# Altium schematic sheet 01_MCU.SchDoc
size A4; SheetNumber: 1; SheetTotal: 5
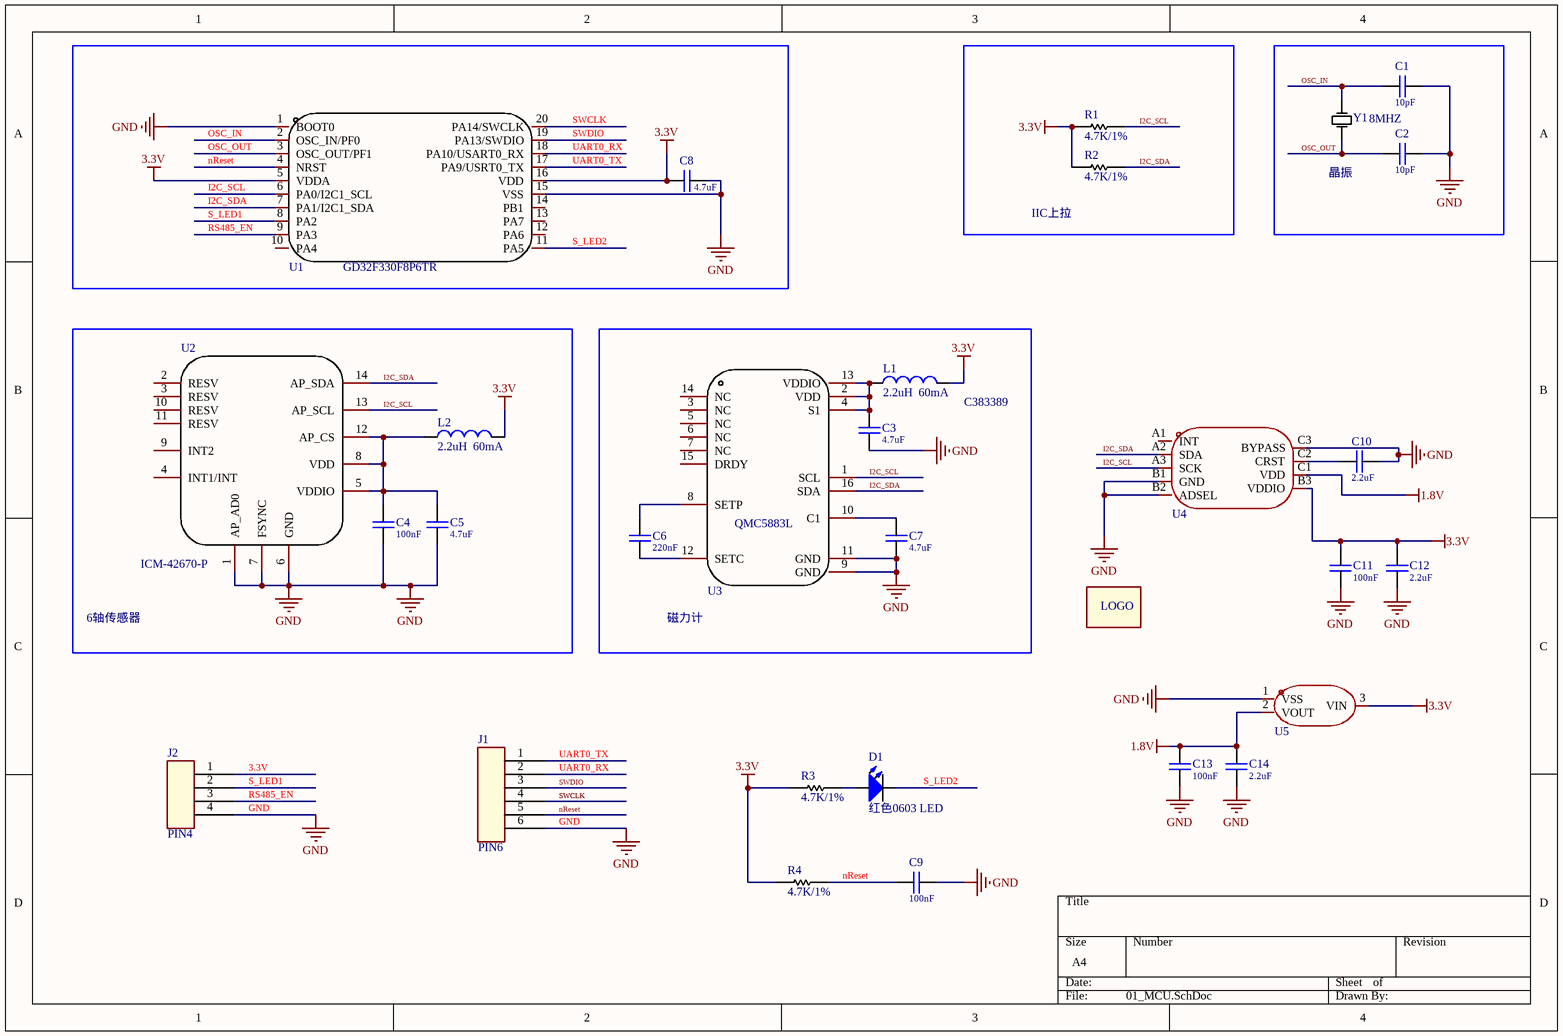
[diagram p0: 01_MCU.SchDoc]

## Parts
C1  10pF  [C0402_M]
C2  10pF  [C0402_M]
C3  4.7uF  [0603C2]
C4  100nF  [C0402_M]
C5  4.7uF  [0603C2]
C6  220nF  [C0402_M]
C7  4.7uF  [0603C2]
C8  4.7uF  [0603C2]
C9  100nF  [C0402_M]
C10  2.2uF  [0603C2]
C11  100nF  [C0402_M]
C12  2.2uF  [0603C2]
C13  100nF  [C0402_M]
C14  2.2uF  [0603C2]
D1  红色0603 LED  [0603_LED_S1]
J1  PIN6  [HDR2.54-LI-6P]
J2  PIN4  [HDR2.54-LI-4P]
L1  2.2uH  60mA  [L0402]
L2  2.2uH  60mA  [L0402]
logo1  JJ_LOGO  [JJ-LOGO]  (value not drawn)
R1  4.7K/1%  [R0402_M]
R2  4.7K/1%  [R0402_M]
R3  4.7K/1%  [R0402_M]
R4  4.7K/1%  [R0402_M]
U1  GD32F330F8P6TR  [TSSOP-20_L6.5-W4.4-P0.65-LS6.4-BL]
U2  ICM-42670-P  [LGA-14_2.5X3.0]
U3  QMC5883L  [LGA-16_L3.0-W3.0-P0.50-BL_SQ]
U4  BMM350  [WLCSP-9_L1.3-W1.3-R3-C3-P0.40-TL]  (value not drawn)
U5  XC6206P182MR  [SOT-23-3_L2.9-W1.6-P1.90-LS2.8-BR]  (value not drawn)
Y1  8MHZ  [OSC-5032-2P]

## Blocks framed on the sheet
IIC上拉: R1 R2
晶振: C1 C2 Y1
6轴传感器: C4 C5 L2 U2

## Nets
1.8V: C13.2 C14.1 U4.C1(VDD) U5.2(VOUT)
3.3V: C8.1 C11.2 C12.1 J2.1 L1.2 L2.2 R1.2 R2.2 R3.2 R4.2 U1.5(VDDA) U1.16(VDD) U4.B3(VDDIO) U5.3(VIN)
GND: C1.2 C2.2 C3.1 C4.1 C5.2 C7.2 C8.2 C9.2 C10.1 C11.1 C12.2 C13.1 C14.2 J1.6 J2.4 U1.1(BOOT0) U1.15(VSS) U2.1(AP_AD0) U2.6(GND) U2.7(FSYNC) U3.9(GND) U3.11(GND) U4.B1(GND) U4.B2(ADSEL) U4.C3(BYPASS) U5.1(VSS)
I2C_SCL: R1.1 U1.6(PA0/I2C1_SCL) U2.13(AP_SCL) U3.1(SCL) U4.A3(SCK)
I2C_SDA: R2.1 U1.7(PA1/I2C1_SDA) U2.14(AP_SDA) U3.16(SDA) U4.A2(SDA)
nReset: C9.1 J1.5 R4.1 U1.4(NRST)
OSC_IN: C1.1 U1.2(OSC_IN/PF0) Y1.2(OSC2)
OSC_OUT: C2.1 U1.3(OSC_OUT/PF1) Y1.1(OSC1)
RS485_EN: J2.3 U1.9(PA3)
S_LED1: J2.2 U1.8(PA2)
S_LED2: D1.2(K) U1.11(PA5)
SWCLK: J1.4 U1.20(PA14/SWCLK)
SWDIO: J1.3 U1.19(PA13/SWDIO)
UART0_RX: J1.2 U1.18(PA10/USART0_RX)
UART0_TX: J1.1 U1.17(PA9/USRT0_TX)
NetC3_2: C3.2 L1.1 U3.2(VDD) U3.4(S1) U3.13(VDDIO)
NetC4_2: C4.2 C5.1 L2.1 U2.5(VDDIO) U2.8(VDD) U2.12(AP_CS)
NetC6_1: C6.1 U3.12(SETC)
NetC6_2: C6.2 U3.8(SETP)
NetC7_1: C7.1 U3.10(C1)
NetC10_2: C10.2 U4.C2(CRST)
NetD1_1: D1.1(A) R3.1

Not connected (* = marked no-connect by the designer): U1 10(PA4) 12(PA6) 13(PA7) 14(PB1); U2 2(RESV) 3(RESV) 4(INT1/INT) 9(INT2) 10(RESV) 11(RESV); U3 3(NC) 5(NC) 6(NC) 7(NC) 14(NC) 15(DRDY); U4 A1(INT)

## Notes on the sheet
- (near L1) C383389
- 磁力计
- (in symbol JJ_LOGO) LOGO

## Library data of the parts
C1 C2 C4 C6 C9 C11 C13 = CAP_0402
C3 C5 C7 C8 C10 C12 C14 = CAP
D1 = LED
L1 L2 = INDUCTOR_0402: MLZ1005M2R2WT000   60mA
R1-R4 = RES-0402
U1 = GD32F330F8P6TR: CPU内核:CM4;程序存储容量:64KB;RAM总容量:8KB;GPIO端口数量:15;工作电压范围:2.6V~3.6V;CPU最大主频:84MHz;程序存储器类型:FLASH;; Manufacturer: GigaDevice(兆易创新); Add into BOM: yes; CPU Core: CM4; Program Storage Size: 64KB; RAM Size: 8KB; GPIO Ports Number: 15; CPU Maximum Speed: 84MHz; Program Memory Type: FLASH; ADC (Bit): 12bit; PWM (Bit): 16bit; 16Bit Timer: 4; 32Bit Timer: 1; UART/USART: 2; Peripheral/Function: 片载温度传感器；DMA；看门狗；LIN总线协议；PWM；除法器；IrDA；乘法器；RTC实时时钟; Watchdog: 有; Symbol: GD32F330F8P6; Device: GD32F330F8P6TR; LCSC Part Name: GD32F330F8P6TR; Supplier Part: C179650; Manufacturer Part: GD32F330F8P6TR; Supplier Footprint: TSSOP-20; JLCPCB Part Class: 扩展库; Datasheet: https://atta.szlcsc.com/upload/public/pdf/source/20180227/C182133_15196977406091370141.pdf; Supplier: LCSC; Convert to PCB: yes; Operating Voltage Range: 2.6V~3.6V; Operating Temperature Range: -40℃~+85℃; DAC (Bit): -; 8Bit Timer: -; CAN: -; I2C: 2; I2S: -; SPI: 2; Universal Serial Bus: -; Internal Comparator: -; communication protocol: -; Real-Time Clock: 有; Infrared Data Association: 有; Low-Voltage Detect: -; CCP Capture/Compare: -; Secure Digital Input and Output: -; Direct Memory Access: 有; Internal Oscillator: 有
U2 = ICM-42670-P: 6-axis; Symbol: HX8001-APC; Add into BOM: yes; Device: HX8001-APC; Convert to PCB: yes
U3 = QMC5883L: Manufacturer: QST(上海矽睿); Add into BOM: yes; Name: QMC5883L; Symbol: QMC5883L; Device: QMC5883L; LCSC Part Name: 三轴磁传感器; Supplier Part: C976032; Manufacturer Part: QMC5883L; Supplier Footprint: LGA-16(3x3x0.9); JLCPCB Part Class: Extended Part; Datasheet: https://atta.szlcsc.com/upload/public/pdf/source/20201217/C976032_5B9A2F3901E175046CBA037B1F18A1F2.pdf; Supplier: LCSC; Convert to PCB: yes
U4 = BMM350_C17225907: Manufacturer: Bosch(博世); Add into BOM: yes; Symbol: BMM350_C17225907; Device: BMM350_C17225907; LCSC Part Name: SHUTTLE BOARD 3.0 BMM350; Supplier Part: C17225907; Manufacturer Part: BMM350; Supplier Footprint: -; JLCPCB Part Class: 扩展库; Datasheet: https://atta.szlcsc.com/upload/public/pdf/source/20241121/E992E1C8BFA98C0A0C5A2C3F6E6F4B25.pdf; Supplier: LCSC; Convert to PCB: yes
U5 = XC6206P182MR_C347373: Manufacturer: UMW(友台半导体); Add into BOM: yes; Output Type: 固定; Maximum Input Voltage: 8V; Output Voltage: 1.8V; Output Current: 250mA; Power Supply Rejection Ratio (PSRR): 40dB@(1kHz); Dropout Voltage: 280mV@(50mA); Output Polarity: 正极; Number of Outputs: 1; Symbol: XC6206P182MR_C347373; Device: XC6206P182MR_C347373; LCSC Part Name: 高纹波抑制率、低功耗、低压差 CMOS 降压型电压稳压器; Supplier Part: C347373; Manufacturer Part: XC6206P182MR; Supplier Footprint: SOT-23; JLCPCB Part Class: 扩展库; Datasheet: https://atta.szlcsc.com/upload/public/pdf/source/20241029/DFB0998C0588718C146C8B83CE14F55A.pdf; Supplier: LCSC; Convert to PCB: yes; standby current: -; Noise: -; Feature: 过流保护(OCP)；短路保护; Operating Temperature: -
Y1 = 8MHZ: CR5032  8MHZ